# EAGLE design M2_Shield_Proto_V1.3 (EAGLE 9.5.2)
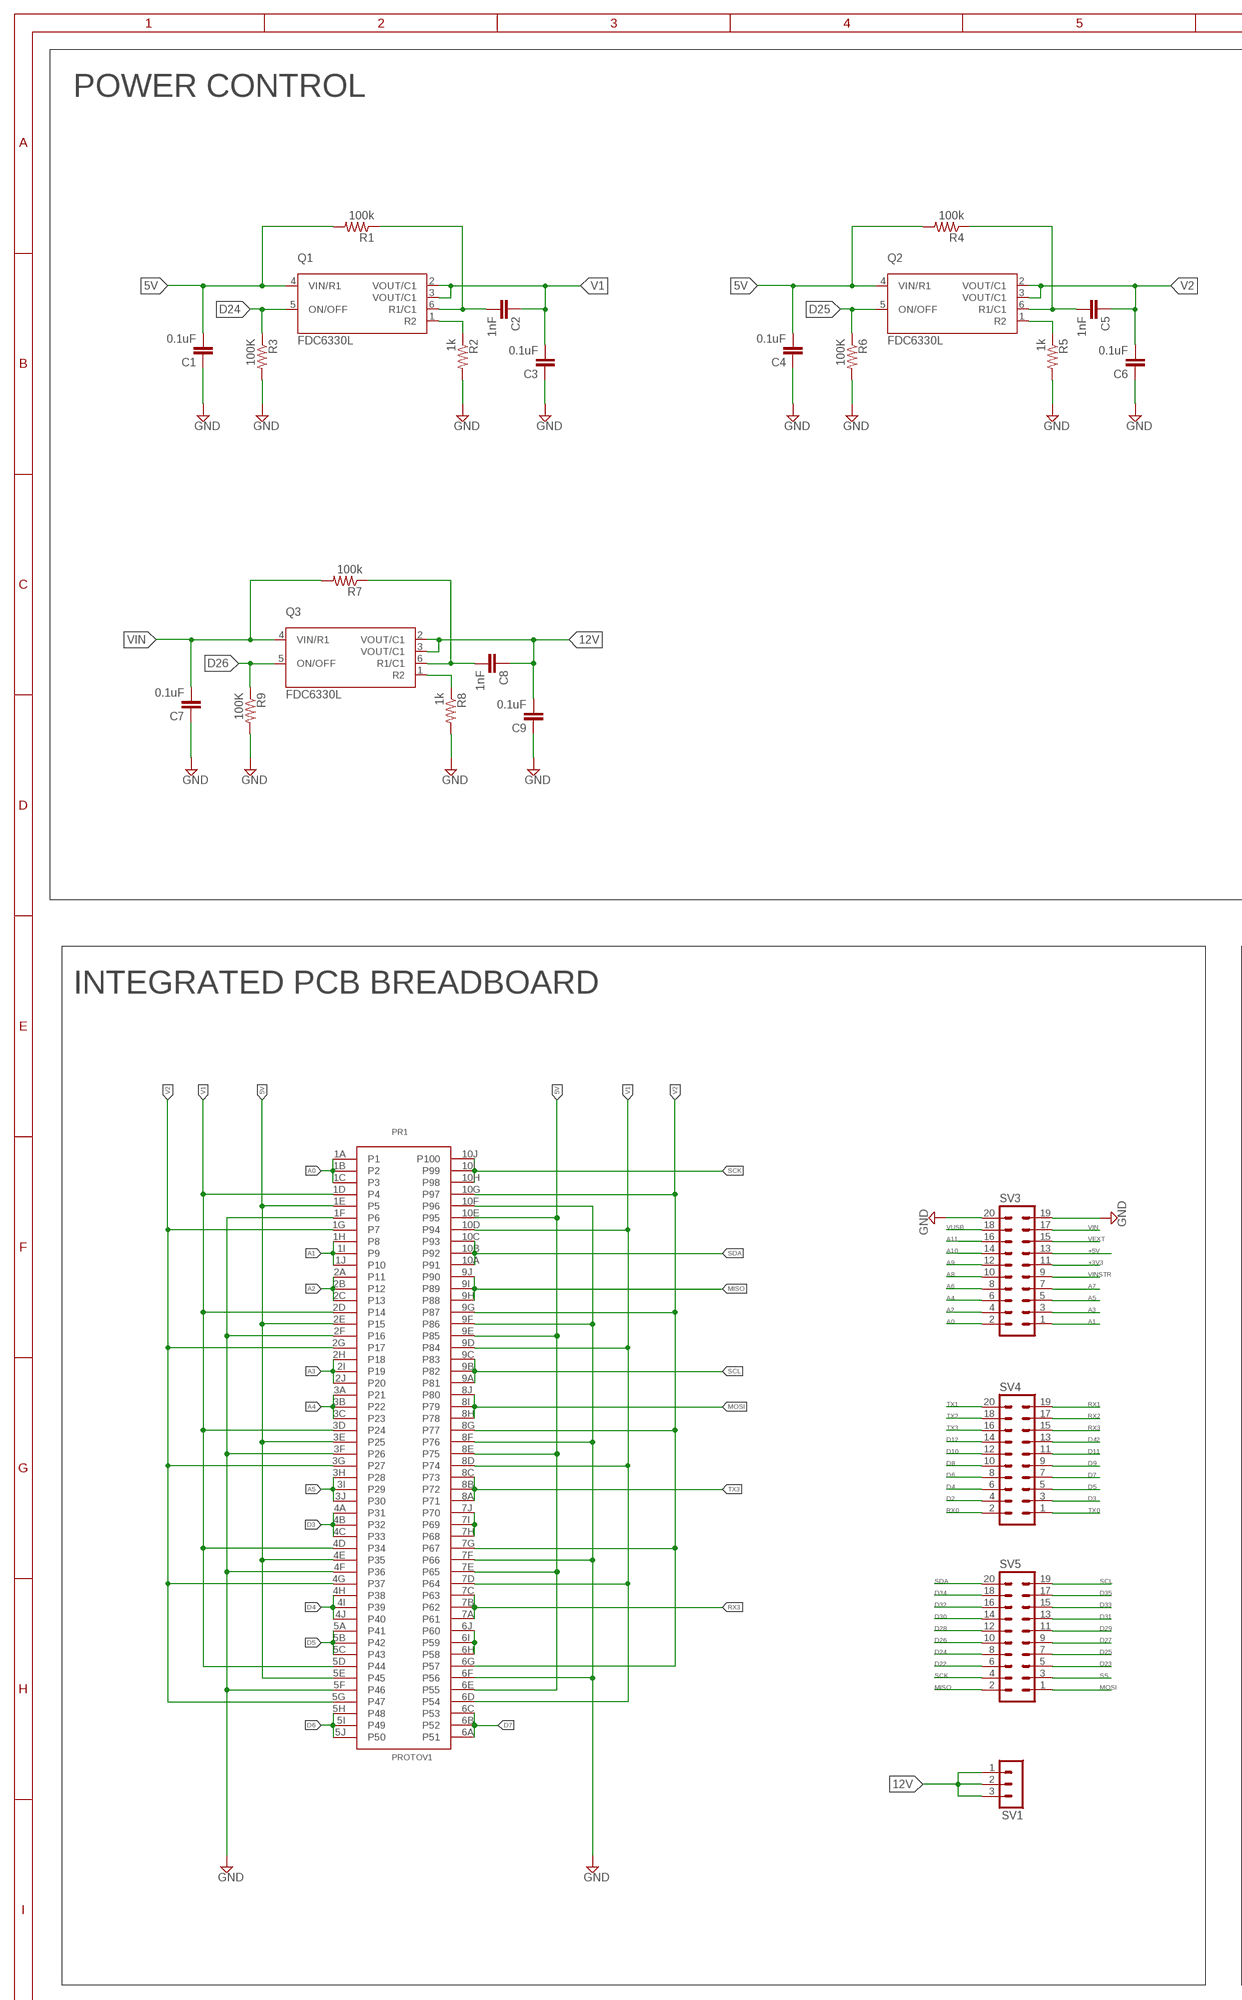
[diagram p0: schematic, sheet 1, part 1 of 2]
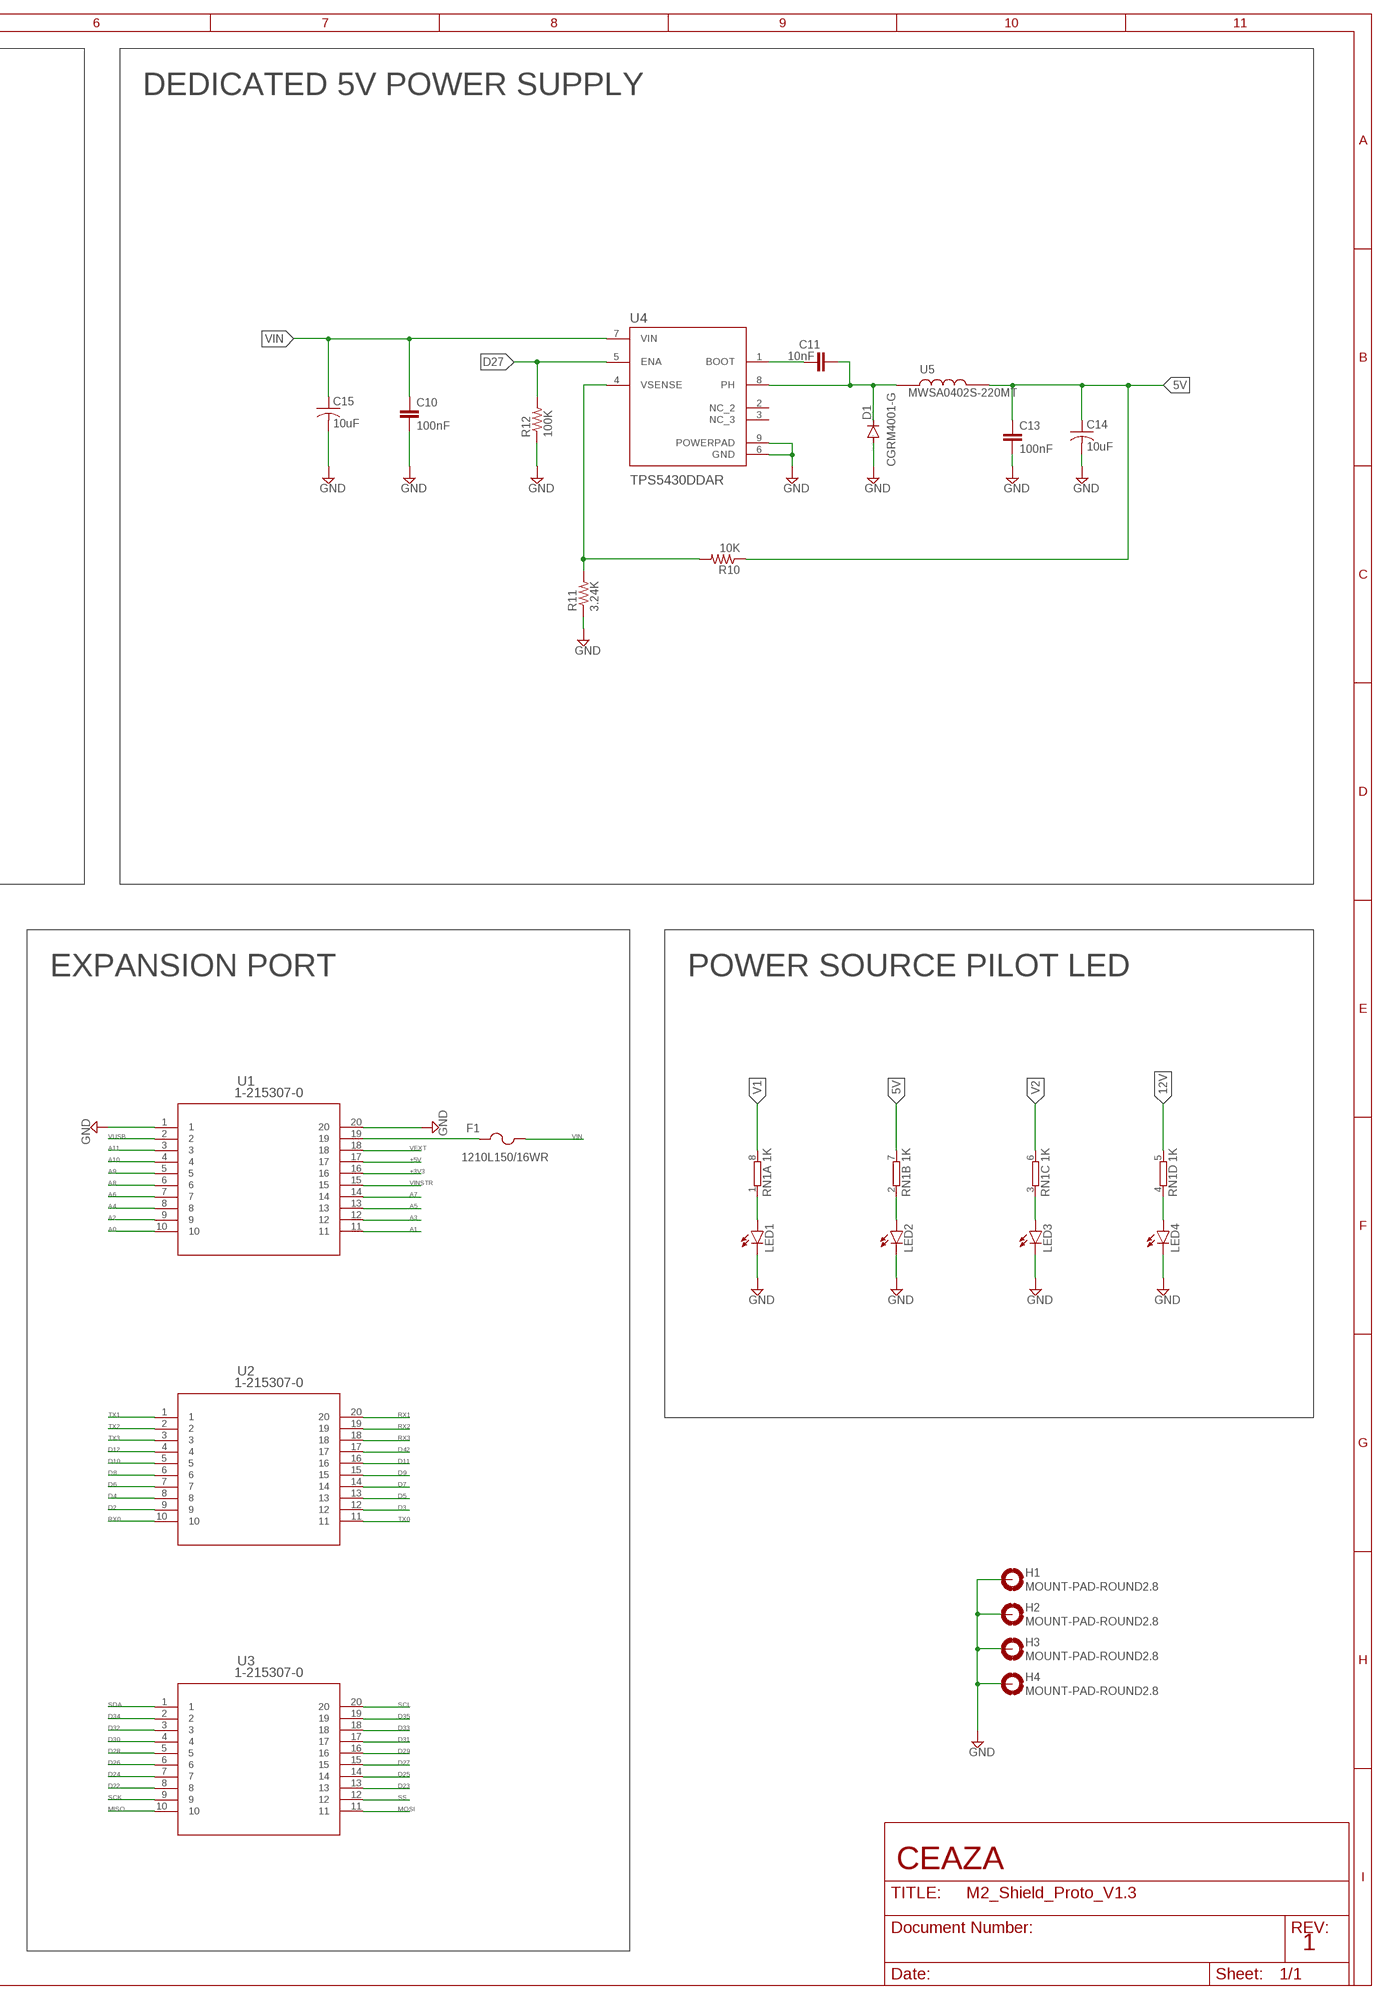
[diagram p1: schematic, sheet 1, part 2 of 2]

## Parts
C1  0.1uF  C-EUC0603  [C0603]
C2  1nF  C-EUC0603  [C0603]
C3  0.1uF  C-EUC0603  [C0603]
C4  0.1uF  C-EUC0603  [C0603]
C5  1nF  C-EUC0603  [C0603]
C6  0.1uF  C-EUC0603  [C0603]
C7  0.1uF  C-EUC0603  [C0603]
C8  1nF  C-EUC0603  [C0603]
C9  0.1uF  C-EUC0603  [C0603]
C10  100nF  C-EUC0603  [C0603]
C11  10nF  C-EUC0603  [C0603]
C13  100nF  C-EUC0603  [C0603]
C14  10uF  C-USC0603  [C0603]
C15  10uF  C-USC0603  [C0603]
D1  CGRM4001-G  [SOD-123_MINI-SMA]
F1  1210L150/16WR  [1210LSERIES]
H1  MOUNT-PAD-ROUND2.8  [2,8-PAD]
H2  MOUNT-PAD-ROUND2.8  [2,8-PAD]
H3  MOUNT-PAD-ROUND2.8  [2,8-PAD]
H4  MOUNT-PAD-ROUND2.8  [2,8-PAD]
LED1  LEDCHIP-LED0805  [CHIP-LED0805]
LED2  LEDCHIP-LED0805  [CHIP-LED0805]
LED3  LEDCHIP-LED0805  [CHIP-LED0805]
LED4  LEDCHIP-LED0805  [CHIP-LED0805]
PR1  PROTOV1  [PROTOV1]
Q1  FDC6330L  [SOT95P280X110-6N]
Q2  FDC6330L  [SOT95P280X110-6N]
Q3  FDC6330L  [SOT95P280X110-6N]
R1  100k  R-US_R0603  [R0603]
R2  1k  R-US_R0603  [R0603]
R3  100K  R-US_R0603  [R0603]
R4  100k  R-US_R0603  [R0603]
R5  1k  R-US_R0603  [R0603]
R6  100K  R-US_R0603  [R0603]
R7  100k  R-US_R0603  [R0603]
R8  1k  R-US_R0603  [R0603]
R9  100K  R-US_R0603  [R0603]
R10  10K  R-US_R0603  [R0603]
R11  3.24K  R-US_R0603  [R0603]
R12  100K  R-US_R0603  [R0603]
RN1  1K  4R-N0603-ARV  [0603-ARV]
SV1  MA03-1  [MA03-1]
SV3  MA10-2  [MA10-2]
SV4  MA10-2  [MA10-2]
SV5  MA10-2  [MA10-2]
U1  1-215307-0  [1-215307-0]
U2  1-215307-0  [1-215307-0]
U3  1-215307-0  [1-215307-0]
U4  TPS5430DDAR  [CONV_TPS5430DDAR]
U5  MWSA0402S-220MT  [MWSA0402S-220MT]

## Nets
5V: C1.2 C4.2 C13.1 C14.1 PR1.1E(P5) PR1.2E(P15) PR1.3E(P25) PR1.4E(P35) PR1.5E(P45) PR1.6E(P55) PR1.7E(P65) PR1.8E(P75) PR1.9E(P85) PR1.10E(P95) Q1.4(VIN/R1) Q2.4(VIN/R1) R1.2 R4.2 R10.1 RN1.7 U5.P$2
12V: C8.1 C9.2 Q3.2(VOUT/C1) Q3.3(VOUT/C1) RN1.5 SV1.1 SV1.2 SV1.3
+3V3: SV3.11 U1.16
+5V: SV3.13 U1.17
A0: PR1.1A(P1) PR1.1B(P2) PR1.1C(P3) SV3.2 U1.10
A1: PR1.1H(P8) PR1.1I(P9) PR1.1J(P10) SV3.1 U1.11
A2: PR1.2A(P11) PR1.2B(P12) PR1.2C(P13) SV3.4 U1.9
A3: PR1.2H(P18) PR1.2I(P19) PR1.2J(P20) SV3.3 U1.12
A4: PR1.3A(P21) PR1.3B(P22) PR1.3C(P23) SV3.6 U1.8
A5: PR1.3H(P28) PR1.3I(P29) PR1.3J(P30) SV3.5 U1.13
A6: SV3.8 U1.7
A7: SV3.7 U1.14
A8: SV3.10 U1.6
A9: SV3.12 U1.5
A10: SV3.14 U1.4
A11: SV3.16 U1.3
D2: SV4.4 U2.9
D3: PR1.4A(P31) PR1.4B(P32) PR1.4C(P33) SV4.3 U2.12
D4: PR1.4H(P38) PR1.4I(P39) PR1.4J(P40) SV4.6 U2.8
D5: PR1.5A(P41) PR1.5B(P42) PR1.5C(P43) SV4.5 U2.13
D6: PR1.5H(P48) PR1.5I(P49) PR1.5J(P50) SV4.8 U2.7
D7: PR1.6A(P51) PR1.6B(P52) PR1.6C(P53) SV4.7 U2.14
D8: SV4.10 U2.6
D9: SV4.9 U2.15
D10: SV4.12 U2.5
D11: SV4.11 U2.16
D12: SV4.14 U2.4
D22: SV5.6 U3.8
D23: SV5.5 U3.13
D24: Q1.5(ON/OFF) R3.1 SV5.8 U3.7
D25: Q2.5(ON/OFF) R6.1 SV5.7 U3.14
D26: Q3.5(ON/OFF) R9.1 SV5.10 U3.6
D27: R12.2 SV5.9 U3.15 U4.5(ENA)
D28: SV5.12 U3.5
D29: SV5.11 U3.16
D30: SV5.14 U3.4
D31: SV5.13 U3.17
D32: SV5.16 U3.3
D33: SV5.15 U3.18
D34: SV5.18 U3.2
D35: SV5.17 U3.19
D42: SV4.13 U2.17
GND: C1.1 C3.1 C4.1 C6.1 C7.1 C9.1 C10.2 C13.2 C14.2 C15.2 D1.A H1.B2,8(MOUNT) H2.B2,8(MOUNT) H3.B2,8(MOUNT) H4.B2,8(MOUNT) LED1.C LED2.C LED3.C LED4.C PR1.1F(P6) PR1.2F(P16) PR1.3F(P26) PR1.4F(P36) PR1.5F(P46) PR1.6F(P56) PR1.7F(P66) PR1.8F(P76) PR1.9F(P86) PR1.10F(P96) R2.2 R3.2 R5.2 R6.2 R8.2 R9.2 R11.1 R12.1 SV3.19 SV3.20 U1.1 U1.20 U4.6(GND) U4.9(POWERPAD)
MISO: PR1.9H(P88) PR1.9I(P89) PR1.9J(P90) SV5.2 U3.10
MOSI: PR1.8H(P78) PR1.8I(P79) PR1.8J(P80) SV5.1 U3.11
N$1: C11.1 U4.1(BOOT)
N$2: LED1.A RN1.1
N$3: LED2.A RN1.2
N$4: LED3.A RN1.3
N$5: LED4.A RN1.4
N$6: C11.2 D1.C U4.8(PH) U5.P$1
N$8: C2.2 Q1.6(R1/C1) R1.1
N$9: Q1.1(R2) R2.1
N$10: C5.2 Q2.6(R1/C1) R4.1
N$11: Q2.1(R2) R5.1
N$12: PR1.6H(P58) PR1.6I(P59) PR1.6J(P60)
N$13: PR1.7H(P68) PR1.7I(P69) PR1.7J(P70)
N$14: R10.2 R11.2 U4.4(VSENSE)
N$15: C8.2 Q3.6(R1/C1) R7.1
N$16: Q3.1(R2) R8.1
N$21: F1.1 U1.19
RX0: SV4.2 U2.10
RX1: SV4.19 U2.20
RX2: SV4.17 U2.19
RX3: PR1.7A(P61) PR1.7B(P62) PR1.7C(P63) SV4.15 U2.18
SCK: PR1.10H(P98) PR1.10I(P99) PR1.10J(P100) SV5.4 U3.9
SCL: PR1.9A(P81) PR1.9B(P82) PR1.9C(P83) SV5.19 U3.20
SDA: PR1.10A(P91) PR1.10B(P92) PR1.10C(P93) SV5.20 U3.1
SS: SV5.3 U3.12
TX0: SV4.1 U2.11
TX1: SV4.20 U2.1
TX2: SV4.18 U2.2
TX3: PR1.8A(P71) PR1.8B(P72) PR1.8C(P73) SV4.16 U2.3
V1: C2.1 C3.2 PR1.1D(P4) PR1.2D(P14) PR1.3D(P24) PR1.4D(P34) PR1.5D(P44) PR1.6D(P54) PR1.7D(P64) PR1.8D(P74) PR1.9D(P84) PR1.10D(P94) Q1.2(VOUT/C1) Q1.3(VOUT/C1) RN1.8
V2: C5.1 C6.2 PR1.1G(P7) PR1.2G(P17) PR1.3G(P27) PR1.4G(P37) PR1.5G(P47) PR1.6G(P57) PR1.7G(P67) PR1.8G(P77) PR1.9G(P87) PR1.10G(P97) Q2.2(VOUT/C1) Q2.3(VOUT/C1) RN1.6
VEXT: SV3.15 U1.18
VIN: C7.2 C10.1 C15.1 F1.2 Q3.4(VIN/R1) R7.2 SV3.17 U4.7(VIN)
VINSTR: SV3.9 U1.15
VUSB: SV3.18 U1.2
Unconnected: U4.2(NC_2) U4.3(NC_3)

## Notes on the sheet
- POWER CONTROL | DEDICATED 5V POWER SUPPLY
- INTEGRATED PCB BREADBOARD | EXPANSION PORT | POWER SOURCE PILOT LED
- CEAZA
- 1

## Library data of the parts
C1-C11 C13 = rcl:C-EU: CAPACITOR, European symbol; SPICEPREFIX: C
C14 C15 = rcl:C-US: CAPACITOR, American symbol; SPICEPREFIX: C
D1 = diode:CGRM400*-G: Molded plasitc,JEDEC SOD-123/Mini SMA Source: Comchip CGRM4001-G.pdf
F1 = 1210L150-16WR:1210L150/16WR; BUILT_BY: EMA_UL_Team; MANUFACTURER_PART_NUMBER: 1210L150/16WR; VENDOR: Littelfuse Inc
H1-H4 = holes:MOUNT-PAD-ROUND: MOUNTING PAD, round
LED1-LED4 = led:LED: LED OSRAM: - CHIPLED LG R971, LG N971, LY N971, LG Q971, LY Q971, LO R971, LY R971 LH N974, LH R974 LS Q976, LO Q976, LY Q976 LO Q996 - Hyper CHIPLED LW Q18S LB Q993, LB Q99A, LB R99A - SideLED LS A670, LO A670, LY A670, LG A670, LP A670 LB A673, LV A673, LT A673, LW A673 LH A674 LY A675 LS A676, LA A676, LO A676, LY A676, LW A676 LS A679, LY A679, LG A679 - Hyper Micro SIDELED® LS Y876, LA Y876, LO Y876, LY Y876 LT Y87S - SmartLED LW L88C, LW L88S LB L89C, LB L89S, LG L890 LS L89K, LO L89K, LY L89K LS L896, LA L896, LO L896, LY L896 - TOPLED LS T670, LO T670, LY T670, LG T670, LP T670 LSG T670, LSP T670, LSY T670, LOP T670, LYG T670 LG T671, LOG T671, LSG T671 LB T673, LV T673, LT T673, LW T673 LH T674 LS T676, LA T676, LO T676, LY T676, LB T676, LH T676, LSB T676, LW T676 LB T67C, LV T67C, LT T67C, LS T67K, LO T67K, LY T67K, LW E67C LS E67B, LA E67B, LO E67B, LY E67B, LB E67C, LV E67C, LT E67C LW T67C LS T679, LY T679, LG T679 LS T770, LO T770, LY T770, LG T770, LP T770 LB T773, LV T773, LT T773, LW T773 LH T774 LS E675, LA E675, LY E675, LS T675 LS T776, LA T776, LO T776, LY T776, LB T776 LHGB T686 LT T68C, LB T68C - Hyper Mini TOPLED® LB M676 - Mini TOPLED Santana® LG M470 LS M47K, LO M47K, LY M47K Source: http://www.osram.convergy.de LUXEON: - LUMILED® LXK2-PW12-R00, LXK2-PW12-S00, LXK2-PW14-U00, LXK2-PW14-V00 LXK2-PM12-R00, LXK2-PM12-S00, LXK2-PM14-U00 LXK2-PE12-Q00, LXK2-PE12-R00, LXK2-PE12-S00, LXK2-PE14-T00, LXK2-PE14-U00 LXK2-PB12-K00, LXK2-PB12-L00, LXK2-PB12-M00, LXK2-PB14-N00, LXK2-PB14-P00, LXK2-PB14-Q00 LXK2-PR12-L00, LXK2-PR12-M00, LXK2-PR14-Q00, LXK2-PR14-R00 LXK2-PD12-Q00, LXK2-PD12-R00, LXK2-PD12-S00 LXK2-PH12-R00, LXK2-PH12-S00 LXK2-PL12-P00, LXK2-PL12-Q00, LXK2-PL12-R00 Source: www.luxeon.com KINGBRIGHT: KA-3528ASYC Source: www.kingbright.com
PR1 = PROTOBOARD:PROTOV1
Q1-Q3 = FDC6330L:FDC6330L: FDC6330 Series 20 V 2.3 A High Side Integrated Load Switch - SSOT-6; DESCRIPTION: Power Switch/Driver 1:1 P-Channel 2.3A SuperSOT™-6; DIGI-KEY_PART_NUMBER: FDC6330LCT-ND; DIGI-KEY_PURCHASE_URL: https://www.digikey.com/product-detail/en/on-semiconductor/FDC6330L/FDC6330LCT-ND/1626189?utm_source=snapeda&utm_medium=aggregator&utm_campaign=symbol; MF: ON Semiconductor; MP: FDC6330L; PACKAGE: TSOT-23-6 ON Semiconductor
R1-R12 = rcl:R-US_: RESISTOR, American symbol; SPICEPREFIX: R
RN1 = resistor-dil:4R-N: Array Chip Resistor Source: RS Component / Phycomp; OC_FARNELL: unknown; OC_NEWARK: unknown
SV1 = con-lstb:MA03-1: PIN HEADER; OC_FARNELL: unknown; OC_NEWARK: unknown
SV3-SV5 = con-lstb:MA10-2: PIN HEADER; OC_FARNELL: unknown; OC_NEWARK: unknown
U1-U3 = 1-215307-0:1-215307-0; BUILT_BY: EMA_UL_Team; MANUFACTURER_PART_NUMBER: 1-215307-0; VENDOR: TE Connectivity
U4 = TPS5430DDAR:TPS5430DDAR: 5.5V to 36V Input, 3A, 500kHz Step-Down Converter 8-SO PowerPAD -40 to 125 Check prices <https://snapeda.com/parts/TPS5430DDAR/Texas%20Instruments/view-part/?ref=eda>; ARROW_ELECTRONICS-PURCHASE-URL: https://snapeda.com/shop?store=Arrow+Electronics&id=423058; AVAILABILITY: Good; DESCRIPTION: 5.5V to 36V Input, 3A, 500kHz Step-Down Converter 8-SO PowerPAD -40 to 125; DIGIKEY-PURCHASE-URL: https://snapeda.com/shop?store=DigiKey&id=423058; MF: Texas Instruments; MOUSER-PURCHASE-URL: https://snapeda.com/shop?store=Mouser&id=423058; MP: TPS5430DDAR; PACKAGE: HSOIC-8 Texas Instruments; PRICE: None; TEXAS_INSTRUMENTS-PURCHASE-URL: https://snapeda.com/shop?store=Texas+Instruments&id=423058
U5 = MWSA0402S-220MT:MWSA0402S-220MT

## Board
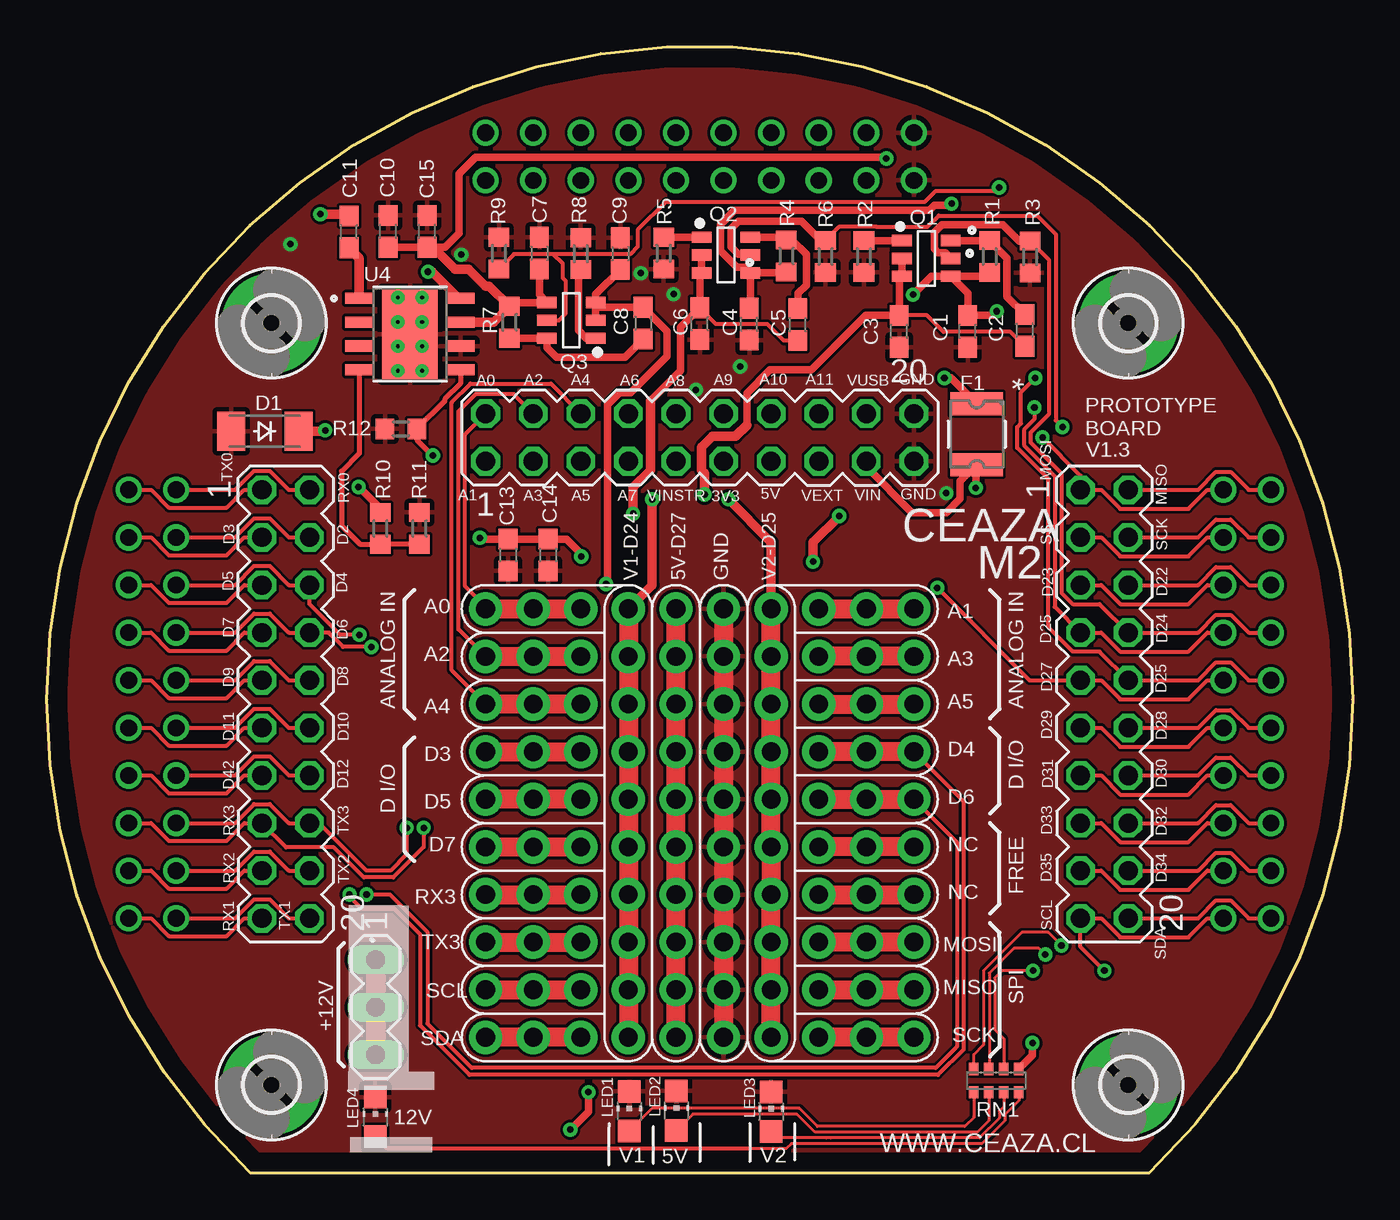
[diagram p2: board, top side]
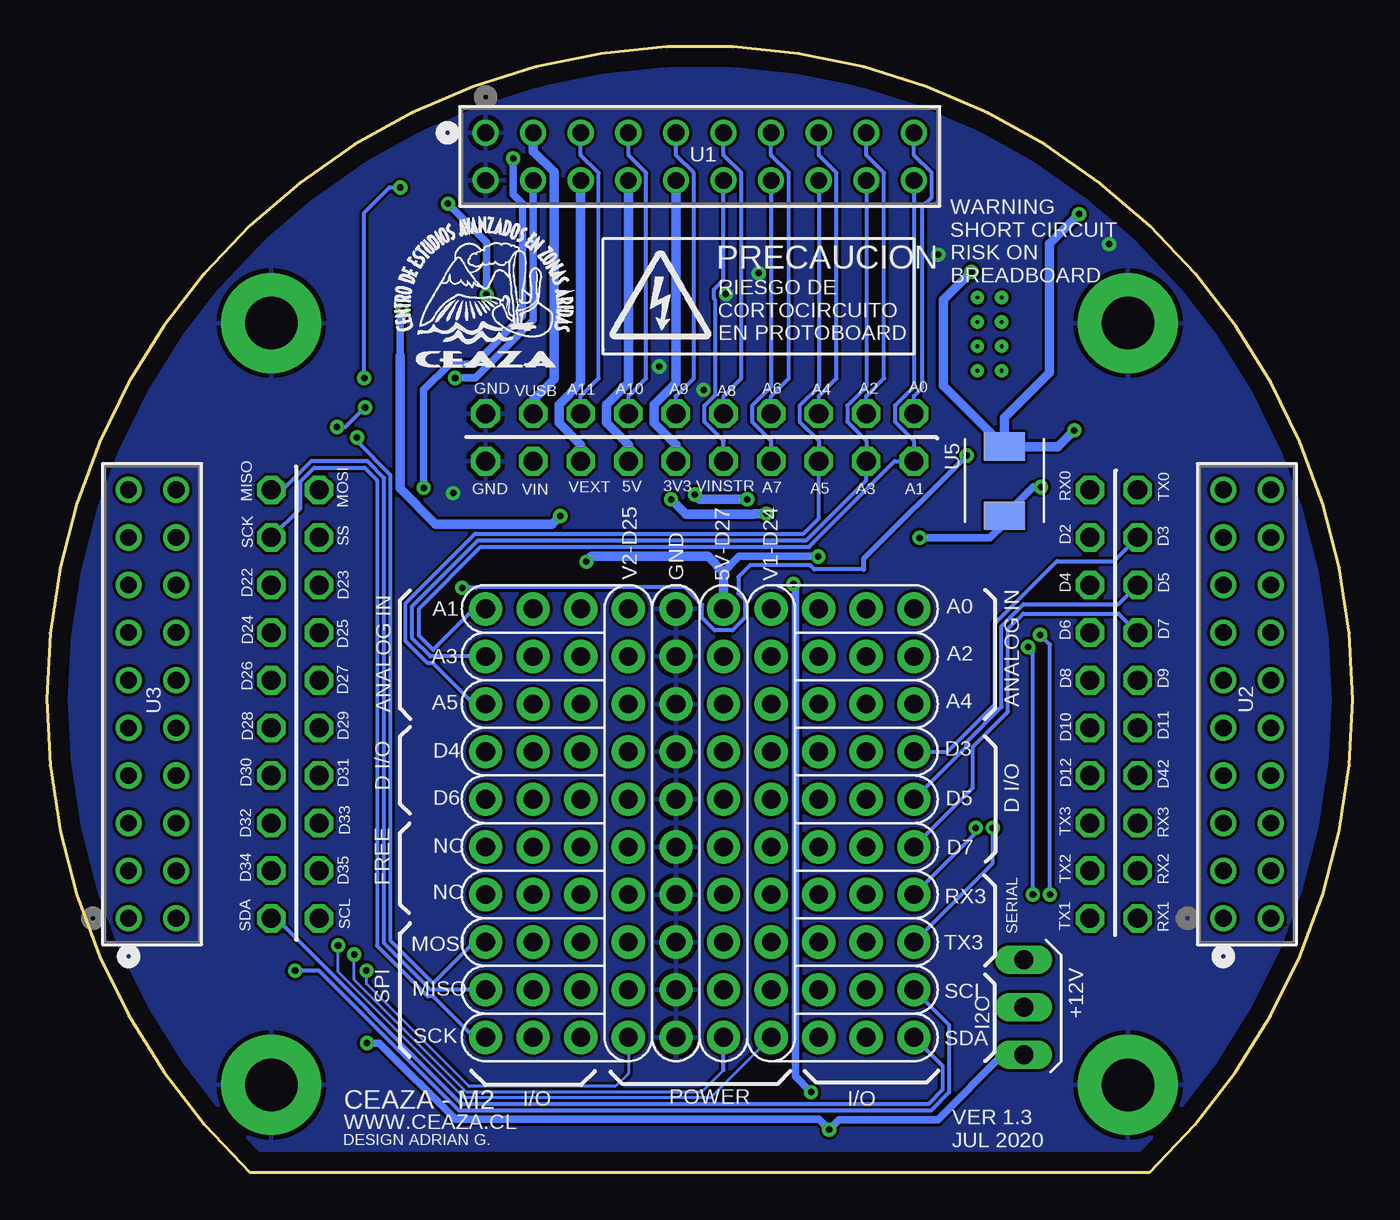
[diagram p3: board, bottom side, seen from below]

Size 69.69 x 60.06 mm. Coordinates in mm from the lower left corner, seen from the top.
Outline: 10.85,0 58.84,0 arc273 10.85,0
Copper layers (1*16): Top 0.035mm / dielectric 1.5mm / Bottom 0.035mm
Design rules "default *": minimum track width 6mil, minimum drill 0.35mm, track to track 6mil, track to pad 6mil, pad to pad 6mil, via to via 6mil, smd to smd 6mil, copper to edge 40mil, drill to drill 6mil, minimum pad ring 10mil, minimum via ring 8mil, stop-mask expansion 2mil, vias tented up to drill 24mil, thermal gap 10mil

### Footprints (pad centres in the part's own frame; a part is rotated, then mirrored left to right if it is on the bottom)
C0603 = smd 1.1 x 1: 1 -0.85,0; 2 0.85,0
SOD-123_MINI-SMA = smd 1.5 x 2.1: A 1.8,0; C -1.8,0
1210LSERIES = smd 1.219 x 2.794: 1 -1.626,0; 2 1.626,0
2,8-PAD = drill 2.8 pad 5.334: B2,8 0,0
CHIP-LED0805 = smd 1.2 x 1.2: A 0,-1.05; C 0,1.05
PROTOV1 = drill 1 pad 1.778: 1A 0,0; 1B 2.54,0; 1C 5.08,0; 1D 7.62,0; 1E 10.16,0; 1F 12.7,0; 1G 15.24,0; 1H 17.78,0; 1I 20.32,0; 1J 22.86,0; 2A 0,-2.54; 2B 2.54,-2.54; 2C 5.08,-2.54; 2D 7.62,-2.54; 2E 10.16,-2.54; 2F 12.7,-2.54; 2G 15.24,-2.54; 2H 17.78,-2.54; 2I 20.32,-2.54; 2J 22.86,-2.54; 3A 0,-5.08; 3B 2.54,-5.08; 3C 5.08,-5.08; 3D 7.62,-5.08; 3E 10.16,-5.08; 3F 12.7,-5.08; 3G 15.24,-5.08; 3H 17.78,-5.08; 3I 20.32,-5.08; 3J 22.86,-5.08; 4A 0,-7.62; 4B 2.54,-7.62; 4C 5.08,-7.62; 4D 7.62,-7.62; 4E 10.16,-7.62; 4F 12.7,-7.62; 4G 15.24,-7.62; 4H 17.78,-7.62; 4I 20.32,-7.62; 4J 22.86,-7.62; 5A 0,-10.16; 5B 2.54,-10.16; 5C 5.08,-10.16; 5D 7.62,-10.16; 5E 10.16,-10.16; 5F 12.7,-10.16; 5G 15.24,-10.16; 5H 17.78,-10.16; 5I 20.32,-10.16; 5J 22.86,-10.16; 6A 0,-12.7; 6B 2.54,-12.7; 6C 5.08,-12.7; 6D 7.62,-12.7; 6E 10.16,-12.7; 6F 12.7,-12.7; 6G 15.24,-12.7; 6H 17.78,-12.7; 6I 20.32,-12.7; 6J 22.86,-12.7; 7A 0,-15.24; 7B 2.54,-15.24; 7C 5.08,-15.24; 7D 7.62,-15.24; 7E 10.16,-15.24; 7F 12.7,-15.24; 7G 15.24,-15.24; 7H 17.78,-15.24; 7I 20.32,-15.24; 7J 22.86,-15.24; 8A 0,-17.78; 8B 2.54,-17.78; 8C 5.08,-17.78; 8D 7.62,-17.78; 8E 10.16,-17.78; 8F 12.7,-17.78; 8G 15.24,-17.78; 8H 17.78,-17.78; 8I 20.32,-17.78; 8J 22.86,-17.78; 9A 0,-20.32; 9B 2.54,-20.32; 9C 5.08,-20.32; 9D 7.62,-20.32; 9E 10.16,-20.32; 9F 12.7,-20.32; 9G 15.24,-20.32; 9H 17.78,-20.32; 9I 20.32,-20.32; 9J 22.86,-20.32; 10A 0,-22.86; 10B 2.54,-22.86; 10C 5.08,-22.86; 10D 7.62,-22.86; 10E 10.16,-22.86; 10F 12.7,-22.86; 10G 15.24,-22.86; 10H 17.78,-22.86; 10I 20.32,-22.86; 10J 22.86,-22.86
SOT95P280X110-6N = smd 1.05 x 0.6: 1 -1.3,0.95; 2 -1.3,0; 3 -1.3,-0.95; 4 1.3,-0.95; 5 1.3,0; 6 1.3,0.95
R0603 = smd 1 x 1.1: 1 -0.85,0; 2 0.85,0
0603-ARV = smd 0.5 x 0.65: 1 -1.2,-0.625; 2 -0.4,-0.625; 3 0.4,-0.625; 4 1.2,-0.625; 5 1.2,0.625; 6 0.4,0.625; 7 -0.4,0.625; 8 -1.2,0.625
MA03-1 = drill 1.016 long: 1 -2.54,0; 2 0,0; 3 2.54,0
MA10-2 = drill 1.016 octagon: 1 -11.43,-1.27; 2 -11.43,1.27; 3 -8.89,-1.27; 4 -8.89,1.27; 5 -6.35,-1.27; 6 -6.35,1.27; 7 -3.81,-1.27; 8 -3.81,1.27; 9 -1.27,-1.27; 10 -1.27,1.27; 11 1.27,-1.27; 12 1.27,1.27; 13 3.81,-1.27; 14 3.81,1.27; 15 6.35,-1.27; 16 6.35,1.27; 17 8.89,-1.27; 18 8.89,1.27; 19 11.43,-1.27; 20 11.43,1.27
1-215307-0 = drill 0.889 pad 1.397: 1 -22.86,2.54; 2 -20.32,2.54; 3 -17.78,2.54; 4 -15.24,2.54; 5 -12.7,2.54; 6 -10.16,2.54; 7 -7.62,2.54; 8 -5.08,2.54; 9 -2.54,2.54; 10 0,2.54; 11 0,0; 12 -2.54,0; 13 -5.08,0; 14 -7.62,0; 15 -10.16,0; 16 -12.7,0; 17 -15.24,0; 18 -17.78,0; 19 -20.32,0; 20 -22.86,0
CONV_TPS5430DDAR = smd 1.55 x 0.6: 1 -2.7,1.905; 2 -2.7,0.635; 3 -2.7,-0.635; 4 -2.7,-1.905; 5 2.7,-1.905; 6 2.7,-0.635; 7 2.7,0.635; 8 2.7,1.905 | smd 2.95 x 4.9: 9 0,0 | drill 0.2 pad 0.3: 10 -0.65,1.95; 11 0.65,1.95; 12 -0.65,0.65; 13 0.65,0.65; 14 -0.65,-0.65; 15 0.65,-0.65; 16 -0.65,-1.95; 17 0.65,-1.95
MWSA0402S-220MT = smd 1.5 x 2.2: P$1 -1.8,0; P$2 1.9,0

### Placement (x,y rotation side)
C1  49.15,44.89 90 top
C2  52.19,44.94 90 top
C3  45.49,44.89 90 top
C4  37.49,45.27 90 top
C5  40.08,45.24 90 top
C6  34.85,45.29 90 top
C7  26.29,49.05 270 top
C8  31.82,45.32 270 top
C9  30.6,49.03 270 top
C10  18.21,50.22 90 top
C11  16.13,50.2 90 top
C13  24.61,32.95 270 top
C14  26.74,32.95 270 top
C15  20.29,50.22 90 top
D1  11.63,39.55 180 top
F1  49.63,39.4 270 top
H1  57.71,45.32 0 top
H2  57.71,4.68 0 top
H3  11.99,4.68 0 top
H4  11.99,45.32 0 top
LED1  31.09,3.28 0 top
LED2  33.6,3.31 0 top
LED3  38.66,3.26 0 top
LED4  17.52,2.98 0 top
PR1  23.42,30.08 0 top
Q1  46.94,48.77 0 top
Q2  36.24,48.95 0 top
Q3  27.99,45.47 180 top
R1  50.31,48.88 270 top
R2  43.61,48.88 270 top
R3  52.47,48.85 270 top
R4  39.47,48.9 270 top
R5  32.91,49.05 270 top
R6  41.55,48.88 270 top
R7  24.69,45.37 90 top
R8  28.5,49.03 90 top
R9  24.13,49.05 90 top
R10  17.8,34.37 270 top
R11  19.88,34.37 270 top
R12  18.89,39.68 0 top
RN1  50.67,4.91 0 top
SV1  17.55,8.82 270 top
SV3  34.85,39.22 0 top
SV4  12.75,25 270 top
SV5  56.44,25 270 top
U1  23.42,52.94 0 bottom
U2  4.37,36.43 90 bottom
U3  62.79,36.43 90 bottom
U4  19.38,44.74 0 top
U5  18.59,36.94 270 bottom

### Tracks (layer width: path | path; a pad name or v marks a point on that pad's centre or on a via)
5V  (via drill 0.35)
  Top 0.152: v53.29,11.64 v53.28,11.64 52.95,11.97 51.61,11.97 50.29,10.65 50.29,5.55 RN1.7
  Top 0.406: Q1.4 50.11,47.82 R1.2 | Q1.4 49.15,46.91 C1.2 50.48,45.74 v50.7,45.96 | Q2.4 39.42,48 R4.2 | C4.2 37.54,46.18 Q2.4 | Q2.4 37.25,48.3 36.83,48.3 35.95,49.17 35.95,50.58 36.71,51.34 47.1,51.34 47.38,51.62 48.2,51.62 v48.28,51.7 | Q1.4 47.21,47.82 v46.22,46.84 | v28.52,32.87 28.52,33.03 27.75,33.8 C14.1 C13.1 23.18,33.8 v23.11,33.87 | v16.63,36.58 17.8,35.41 R10.1
  Top 0.508: v40.89,32.59 40.89,33.64 v42.29,35.03
  Top 1.016: PR1.1E PR1.2E PR1.3E PR1.4E PR1.5E PR1.6E PR1.7E PR1.8E PR1.9E PR1.10E
  Bottom 0.152: 33.58,5.47 34.74,4.3 47.28,4.3 53.29,10.3 v53.29,11.64
  Bottom 0.203: 33.58,5.47 PR1.10E
  Bottom 0.406: v46.22,46.84 46.22,49.64 v48.28,51.7 | v28.52,32.87 32.74,32.87 33.58,32.04 | 50.85,43.59 50.85,45.8 v50.7,45.96 | v23.11,33.87 19.35,33.87 18.59,34.63 U5.P$2 17.05,36.58 v16.63,36.58
  Bottom 0.508: PR1.1E 33.58,32.04 34.41,32.87 40.61,32.87 v40.89,32.59 | v42.29,35.03 42.72,34.6 48.94,34.6 50.85,36.51 50.85,43.59 | U5.P$2 18.59,35.02
12V  (via drill 0.35)
  Top 0.406: C9.2 29.29,46.86 Q3.3 | Q3.3 Q3.2 | Q3.3 29.54,46.17 C8.1 33.09,44.9 33.09,43.57 31.14,41.61 30.57,41.61 29.92,40.96 29.92,31.48 v29.84,31.4 | v28.9,4.3 28.9,3.26 v27.94,2.29 | v52.6,6.92 52.6,6.26 RN1.5
  Top 1.016: SV1.1 SV1.2 SV1.3
  Bottom 0.406: v29.84,31.4 29.74,31.3 29.74,5.13 v28.9,4.3 | v52.6,6.92 51.95,6.92 47.88,2.85 28.5,2.85 v27.94,2.29 27.4,2.83 22.15,2.83 18.69,6.28 SV1.3
+3V3
  Bottom 0.508: U1.16 36.12,42.15 37.28,40.98 37.28,40.01 36.12,38.84 SV3.11
+5V
  Bottom 0.508: U1.17 38.66,42.15 39.82,40.98 39.82,40.01 38.66,38.84 SV3.13
A0
  Top 0.203: PR1.1A 23.52,30.08 22.32,31.27 22.32,39.4 SV3.2
  Top 1.016: PR1.1A PR1.1B PR1.1C
  Bottom 0.203: SV3.2 23.42,41.43 22.96,41.89 22.96,51.56 22.46,52.05 22.46,53.34 23.42,54.29 U1.10
A1
  Top 1.016: PR1.1H PR1.1I PR1.1J
  Bottom 0.203: U1.11 23.42,41.93 24.43,40.91 24.43,40.07 23.42,39.06 SV3.1 24.44,37.95 29.01,33.38 46.53,33.38 49.83,30.08 49.83,28.66 49.07,27.9 46.89,30.08 PR1.1J
A2
  Top 0.203: PR1.2A 21.97,28.99 21.97,40.62 22.89,41.54 24.91,41.54 SV3.4
  Top 1.016: PR1.2A PR1.2B PR1.2C
  Bottom 0.203: SV3.4 25.96,41.43 25,42.38 25,53.34 25.96,54.29 U1.9
A3
  Top 1.016: PR1.2J PR1.2I PR1.2H
  Bottom 0.203: U1.12 25.96,41.93 26.97,40.91 26.97,40.07 25.96,39.06 SV3.3 25.96,36.94 29.16,33.74 46.68,33.74 50.19,30.23 50.19,28.51 49.22,27.54 PR1.2J
A4
  Top 0.203: PR1.3A 21.61,26.8 21.61,41.09 22.61,42.09 26.9,42.09 SV3.6
  Top 1.016: PR1.3C PR1.3B PR1.3A
  Bottom 0.203: SV3.6 28.5,41.43 27.54,42.38 27.54,53.34 28.5,54.29 U1.8
A5
  Top 1.016: PR1.3H PR1.3I PR1.3J
  Bottom 0.203: U1.13 28.5,41.93 29.51,40.91 29.51,40.07 28.5,39.06 SV3.5 28.5,34.91 29.31,34.09 46.82,34.09 50.54,30.37 50.54,28.36 49.36,27.18 49.07,27.18 46.89,25 PR1.3J
A6
  Bottom 0.203: SV3.8 31.04,41.43 30.08,42.38 30.08,53.34 31.04,54.29 U1.7
A7
  Bottom 0.203: U1.14 31.04,41.93 32.05,40.91 32.05,40.07 31.04,39.06 SV3.7
A8
  Bottom 0.203: SV3.10 33.58,41.43 32.62,42.38 32.62,53.34 33.58,54.29 U1.6
A9
  Bottom 0.203: SV3.12 36.12,41.43 35.16,42.38 35.16,53.34 36.12,54.29 U1.5
A10
  Bottom 0.203: SV3.14 38.66,41.43 37.7,42.38 37.7,53.34 38.66,54.29 U1.4
A11
  Bottom 0.203: SV3.16 41.2,41.43 40.24,42.38 40.24,53.34 41.2,54.29 U1.3
D2
  Top 0.203: U2.9 10.04,33.89 11.06,34.91 11.9,34.91 12.91,33.89 SV4.4
D3
  Top 0.203: SV4.3 10.54,33.89 9.59,32.94 6.51,32.94 5.56,33.89 U2.12
  Top 1.016: PR1.4A PR1.4B PR1.4C
  Bottom 0.203: PR1.4A 21.64,22.46 19.1,25 19.1,29.31 15.79,32.62 12.75,32.62 SV4.3
D4  (via drill 0.35)
  Top 0.203: U2.8 10.04,31.35 11.06,32.37 11.9,32.37 12.91,31.35 SV4.6 14.02,30.33 15.66,28.69 v16.68,28.69 | PR1.4J 48.92,19.82 48.92,6.57 47.57,5.21 22.56,5.21 19.92,7.85 19.92,12.73 18.54,14.11 16.76,14.11 16.16,14.71 v16.16,14.84
  Top 1.016: PR1.4J PR1.4I PR1.4H
  Bottom 0.203: v16.16,14.84 16.16,28.17 v16.68,28.69
D5
  Top 0.203: SV4.5 10.54,31.35 9.59,30.4 6.51,30.4 5.56,31.35 U2.13
  Top 1.016: PR1.5C PR1.5B PR1.5A
  Bottom 0.203: PR1.5A 20.62,22.71 20.62,22.97 18.74,24.85 18.74,29.16 17.57,30.33 12.49,30.33 SV4.5
D6  (via drill 0.35)
  Top 0.203: U2.7 10.04,28.81 11.06,29.83 11.9,29.83 12.91,28.81 SV4.8 15.04,28.81 15.8,28.05 v17.32,28.05 | PR1.5J 48.56,17.63 48.56,6.71 47.44,5.59 22.68,5.59 20.32,7.96 20.32,12.83 18.31,14.84 v17.07,14.84
  Top 1.016: PR1.5H PR1.5I PR1.5J
  Bottom 0.203: v17.07,14.84 17.07,27.79 v17.32,28.05
D7
  Top 0.203: SV4.7 10.54,28.81 9.59,27.86 6.51,27.86 5.56,28.81 U2.14
  Top 1.016: PR1.6A PR1.6B PR1.6C
  Bottom 0.203: PR1.6A 20.27,20.53 20.27,22.72 18.39,24.6 18.39,29.01 17.57,29.83 12.49,29.83 SV4.7
D8
  Top 0.203: U2.6 10.04,26.27 11.06,27.29 11.9,27.29 12.91,26.27 SV4.10
D9
  Top 0.203: SV4.9 10.54,26.27 9.59,25.32 6.51,25.32 5.56,26.27 U2.15
D10
  Top 0.203: U2.5 10.04,23.73 11.06,24.75 11.9,24.75 12.91,23.73 SV4.12
D11
  Top 0.203: SV4.11 10.54,23.73 9.59,22.78 6.51,22.78 5.56,23.73 U2.16
D12
  Top 0.203: U2.4 10.04,21.19 11.06,22.21 11.9,22.21 12.91,21.19 SV4.14
D22
  Top 0.203: SV5.6 61.44,31.35 62.39,32.3 63.18,32.3 64.13,31.35 U3.8
D23
  Top 0.203: U3.13 61.94,31.35 60.93,30.33 57.28,30.33 56.27,31.35 SV5.5
D24
  Top 0.203: U3.7 64.13,28.81 63.18,29.76 62.39,29.76 61.44,28.81 SV5.8 56.18,30.33 54.74,30.33 54.15,30.93 54.15,37.31 52.5,38.96 52.5,39.49 53.46,40.45 53.46,48.71 R3.1
  Top 0.406: Q1.5 47.94,49.07 47.56,49.07 47.36,49.28 47.36,50.17 47.77,50.58 51.01,50.58 51.89,49.7 R3.1
D25  (via drill 0.35)
  Top 0.203: U3.14 61.94,28.81 60.93,27.79 57.28,27.79 56.27,28.81 SV5.7 53.79,30.18 53.79,37.17 52.15,38.82 52.15,39.63 52.7,40.19 v52.7,40.82 | v54.2,39.78 53.84,40.14 53.84,50.07 52.85,51.06 47.6,51.06 46.99,50.45 44.29,50.45 44.26,50.48 42.31,50.48 R6.1
  Top 0.406: R6.1 41.3,49.73 40.27,50.76 36.92,50.76 36.51,50.35 36.51,49.4 36.92,48.99 37.5,48.99 Q2.5
  Bottom 0.203: v54.2,39.78 53.74,39.78 v52.7,40.82
D26  (via drill 0.35)
  Top 0.203: U3.6 64.13,26.27 63.18,27.22 62.39,27.22 61.44,26.27 SV5.10 56.18,27.79 54.74,27.79 53.44,29.1 53.44,37.02 51.79,38.67 51.79,39.78 51.99,39.98 51.99,41.64 v52.75,42.4 | 27.02,49.01 31.14,49.01 31.54,49.4 31.54,50.3 33.03,51.8 46.86,51.8 47.42,52.36 50.62,52.36 v50.82,52.56 | 27.02,49.01 25.68,49.01 25.68,49 24.93,49 R9.1 | Q3.5 27.33,45.47 27.71,45.85 27.71,47.56 27.54,47.73 27.54,48.49 27.02,49.01
  Bottom 0.203: v52.75,42.4 52.75,51.21 51.41,52.56 v50.82,52.56
D27  (via drill 0.35)
  Top 0.203: U3.15 61.94,26.27 60.93,25.25 57.28,25.25 56.27,26.27 SV5.9 52.45,26.27 v47.52,31.2
  Top 0.254: U4.5 22.08,42.1 21.23,41.25 21.23,41.17 R12.2 19.74,39.11 v20.6,38.26
  Bottom 0.203: 26.08,32.19 28.73,32.19 28.96,32.42 32.15,32.42 32.79,31.78 32.79,30.91 32.43,30.55 32.43,29.61 33.1,28.94 34.05,28.94 34.72,29.61 34.72,30.3 35.64,31.22 46.75,31.22 46.77,31.2 v47.52,31.2
  Bottom 0.254: 26.08,32.19 26.08,32.77 v20.6,38.26
D28
  Top 0.203: SV5.12 61.44,23.73 62.39,24.68 63.18,24.68 64.13,23.73 U3.5
D29
  Top 0.203: U3.16 61.94,23.73 60.93,22.71 57.28,22.71 56.27,23.73 SV5.11
D30
  Top 0.203: SV5.14 61.44,21.19 62.39,22.14 63.18,22.14 64.13,21.19 U3.4
D31
  Top 0.203: U3.17 61.94,21.19 60.93,20.17 57.28,20.17 56.27,21.19 SV5.13
D32
  Top 0.203: SV5.16 61.44,18.65 62.39,19.6 63.18,19.6 64.13,18.65 U3.3
D33
  Top 0.203: U3.18 61.94,18.65 60.93,17.63 57.28,17.63 56.27,18.65 SV5.15
D34
  Top 0.203: SV5.18 61.44,16.11 62.39,17.06 63.18,17.06 64.13,16.11 U3.2
D35
  Top 0.203: U3.19 61.94,16.11 60.93,15.09 57.28,15.09 56.27,16.11 SV5.17
D42
  Top 0.203: SV4.13 10.54,21.19 9.59,20.24 6.51,20.24 5.56,21.19 U2.17
GND  (via drill 0.35)
  Top 1.016: PR1.1F PR1.2F PR1.3F PR1.4F PR1.5F PR1.6F PR1.7F PR1.8F PR1.9F PR1.10F
  other vias: 48,36.25 22.12,48.98 13,49.54 33.45,46.87 34.64,41.76 37,43.01 31.7,47.99
  pour Top: 0.25,55.38 -1.48,10.78 11.22,-1.92 57.71,-1.92 70.66,11.03 70.66,40.24 53.39,57.51 51.86,57.51 47.8,61.58 29.03,61.58
  pour Bottom: -2.24,37.45 -2.24,11.28 10.72,-1.67 59.48,-1.67 68.12,6.97 71.17,10.01 71.17,37.95 71.17,40.49 54.4,57.26 50.34,61.32 28.75,61.32 18.34,61.32 8.94,51.92 -1.73,41.26 -1.73,38.46
MISO
  Top 0.203: SV5.2 61.44,36.43 62.39,37.38 63.18,37.38 64.13,36.43 U3.10
  Top 1.016: PR1.9H PR1.9I PR1.9J
  Bottom 0.203: PR1.9J 49.22,9.76 51.71,12.25 51.71,37.09 52.59,37.97 55.57,37.97 57.11,36.43 SV5.2
MOSI  (via drill 0.35)
  Top 0.203: U3.11 61.94,36.43 60.93,35.41 57.28,35.41 56.27,36.43 SV5.1 55.17,37.19 v53.13,39.22
  Top 1.016: PR1.8J PR1.8I PR1.8H
  Bottom 0.203: PR1.8J 46.89,12.3 49.07,10.12 51.36,12.4 51.36,37.23 53.13,39.01 v53.13,39.22
N$1
  Top 0.508: C11.1 16.68,48.8 U4.1
N$2
  Top 0.152: RN1.1 49.47,2.98 49.49,2.97 48.99,2.47 41.12,2.47 40.15,3.44 32.29,3.44 LED1.A
N$3
  Top 0.152: RN1.2 50.27,2.78 49.65,2.17 40.99,2.17 40.03,3.13 34.47,3.13 LED2.A
N$4
  Top 0.152: RN1.3 51.07,3.53 50.82,3.28 50.82,2.9 49.78,1.86 41.83,1.86 41.6,1.86 39,1.86 LED3.A
N$5
  Top 0.152: RN1.4 51.87,3.83 51.13,3.09 51.13,2.78 49.91,1.56 39.73,1.56 39.45,1.28 37.44,1.28
  Top 0.203: 37.44,1.28 18.17,1.28 LED4.A
N$6  (via drill 0.35)
  Top 0.508: v14.6,51.14 16.04,51.14 C11.2 | D1.C 14.8,39.55 v14.86,39.61 | v20.34,48.06 20.55,48.06 21.97,46.64 U4.8
  Bottom 0.508: v14.6,51.14 16.18,49.56 16.18,42.68 18.59,40.26 U5.P$1 | v14.86,39.61 15.72,38.74 U5.P$1 | U5.P$1 21.84,41.99 21.84,46.57 v20.34,48.06
N$8
  Top 0.406: Q1.6 R1.1 51.25,48.8 51.25,46.74 C2.2
N$9
  Top 0.406: Q1.1 R2.1
N$10
  Top 0.406: Q2.6 39.32,49.9 R4.1 39.77,49.75 40.53,49 40.53,47.35 40.08,46.91 C5.2
N$11
  Top 0.406: Q2.1 R5.1
N$12
  Top 1.016: PR1.6J PR1.6I PR1.6H
N$13
  Top 1.016: PR1.7H PR1.7I PR1.7J
N$14
  Top 0.254: R11.2 R10.2 16.72,33.52 15.72,34.53 15.72,37.42 16.68,38.38 U4.4
N$15
  Top 0.406: R7.1 Q3.6 | Q3.6 | C8.2 30.84,43.49 27.2,43.49 26.69,44.01 Q3.6
N$16
  Top 0.406: Q3.1 28.79,44.52 28.37,44.94 28.37,48.05 R8.1
N$21  (via drill 0.35)
  Top 0.406: v47.9,42.4 48.26,42.4 F1.1
  Bottom 0.406: U1.19 43.74,45.47 46.81,42.4 v47.9,42.4
RX0
  Top 0.203: U2.10 10.04,36.43 11.06,37.45 11.9,37.45 12.91,36.43 SV4.2
RX1
  Top 0.203: SV4.19 10.54,13.57 9.59,12.62 6.51,12.62 5.56,13.57 U2.20
RX2
  Top 0.203: SV4.17 10.54,16.11 9.59,15.16 6.51,15.16 5.56,16.11 U2.19
RX3  (via drill 0.35)
  Top 0.203: U2.18 5.56,18.65 6.51,17.7 9.59,17.7 10.54,18.65 SV4.15 12.77,17.36 15.31,17.36 16.92,15.75 18.48,15.75 20.11,17.38 v20.11,18.4
  Top 1.016: PR1.7A PR1.7B PR1.7C
  Bottom 0.203: PR1.7A 20.11,18.14 v20.11,18.4
SCK
  Top 0.203: SV5.4 61.44,33.89 62.39,34.84 63.18,34.84 64.13,33.89 U3.9
  Top 1.016: PR1.10J PR1.10I PR1.10H
  Bottom 0.203: PR1.10J 46.89,7.22 49.07,9.4 49.36,9.4 52.07,12.11 52.07,36.94 52.74,37.61 55.42,37.61 56.18,36.85 56.18,35.41 SV5.4
SCL  (via drill 0.35)
  Top 0.203: U3.20 61.94,13.57 60.93,12.55 57.28,12.55 56.27,13.57 SV5.19 55.17,12.05 v56.44,10.78
  Top 1.016: PR1.9A PR1.9B PR1.9C
  Bottom 0.203: PR1.9A 21.54,7.88 21.54,4.28 22.51,3.31 47.69,3.31 55.16,10.78 v56.44,10.78
SDA
  Top 0.203: SV5.20 61.44,13.57 62.39,14.52 63.18,14.52 64.13,13.57 U3.1
  Top 1.016: PR1.10C PR1.10B PR1.10A
  Bottom 0.203: PR1.10A 21.89,5.7 21.89,4.43 22.65,3.66 47.55,3.66 57.45,13.57 SV5.20
SS
  Top 0.203: U3.12 61.94,33.89 60.93,32.87 57.28,32.87 56.27,33.89 SV5.3
TX0
  Top 0.203: SV4.1 10.54,36.43 9.59,35.48 6.51,35.48 5.56,36.43 U2.11
TX1
  Top 0.203: U2.1 10.04,13.57 11.06,14.59 11.9,14.59 12.91,13.57 SV4.20
TX2
  Top 0.203: U2.2 10.04,16.11 11.06,17.13 11.9,17.13 12.91,16.11 SV4.18
TX3  (via drill 0.35)
  Top 0.203: U2.3 10.04,18.65 11.06,19.67 11.9,19.67 12.91,18.65 SV4.16 14.53,18.65 17.07,16.11 18.34,16.11 19.2,16.98 v19.2,18.4
  Top 1.016: PR1.8A PR1.8B PR1.8C
  Bottom 0.203: PR1.8A 19.2,16.51 v19.2,18.4
V1  (via drill 0.35)
  Top 0.152: RN1.8 49.47,6.3 49.98,6.81 49.98,10.78 52.03,12.82 53.45,12.82 v54.14,12.12
  Top 0.203: C2.1 51.42,44.86 47.85,44.86 46.97,45.74 C3.2
  Top 0.406: 37.36,39.88 37.36,41.59 38.6,42.83 40.81,42.83 43.72,45.74 C3.2 45.49,47.68 Q1.3 Q1.2
  Top 0.508: PR1.1D 32.31,31.35 v32.31,35.92 | 37.36,39.88 36.75,39.28 35.53,39.28 34.95,38.69 34.95,37.47 35.1,37.32 v35.1,36.18
  Top 1.016: PR1.1D PR1.2D PR1.3D PR1.4D PR1.5D PR1.6D PR1.7D PR1.8D PR1.9D PR1.10D
  Bottom 0.152: PR1.10D 34.26,3.99 47.41,3.99 54.14,10.73 v54.14,12.12
  Bottom 0.508: v32.31,35.92 34.85,35.92 v35.1,36.18
V2  (via drill 0.35)
  Top 0.152: RN1.6 51.07,7.15 50.59,7.63 50.59,10.4 50.97,10.78 v52.63,10.78
  Top 0.203: C5.1 39.33,44.39 38.45,45.27 35.72,45.27 C6.2
  Top 0.406: Q2.2 Q2.3 34.85,47.91 C6.2 33.8,45.1 33.8,42.78 32.2,41.18
  Top 0.508: v31.29,35.16 31.29,36.56 32.2,37.47 32.2,41.18 | v36.37,35.92 38.66,33.64 PR1.1G
  Top 1.016: PR1.10G PR1.9G PR1.8G PR1.7G PR1.6G PR1.5G PR1.4G PR1.3G PR1.2G PR1.1G
  Bottom 0.152: PR1.10G 38.66,5.29 39.34,4.6 47.16,4.6 52.63,10.07 v52.63,10.78
  Bottom 0.508: v31.29,35.16 31.96,35.16 31.98,35.14 35.58,35.14 v36.37,35.92
VEXT
  Bottom 0.508: U1.18 41.2,42.15 42.36,40.98 42.36,40.01 41.2,38.84 SV3.15
VIN  (via drill 0.35)
  Top 0.406: R7.2 24.89,46.42 Q3.4 26.29,46.82 C7.2 | C10.1 C15.1 21.24,49.37 21.99,50.12 21.99,53.3 22.88,54.19 44.73,54.19 v44.8,54.11 | SV3.17 43.74,37.65 46.17,35.21 48,35.21 48.74,35.95 48.74,36.88 F1.2 49.58,37.73 v49.58,36.53
  Top 0.508: C15.1 20.62,49.37 21.8,48.19 22.51,48.19 23.41,47.3 23.61,47.3 R7.2 23.84,45.37 U4.7
  Bottom 0.406: v44.8,54.11 44.8,52.2 44.29,51.7 44.29,45.7 46.87,43.13 48.21,43.13 49.58,41.76 v49.58,36.53
VINSTR
  Bottom 0.203: SV3.9 33.58,39.06 34.59,40.07 34.59,40.91 34.01,41.5 34.01,46.54 34.08,46.61 34.08,47.13 33.58,47.64 U1.15
VUSB
  Bottom 0.508: SV3.18 43.74,41.21 42.63,42.32 42.63,53.4 43.74,54.5 U1.2

### Text on the board
tPlace: A0 | A2 | A4 | A6 | A8 | A9 | A10 | A11 | VUSB | GND | PROTOTYPE / BOARD | V1.3 | TX0 | MOSI | RX0 | A1 | A3 | A5 | A7 | VINSTR | 3V3 | 5V | VEXT | VIN | GND | MISO | CEAZA | D3 | D2 | SS | SCK | V1-D24 | 5V-D27 | GND | V2-D25 | M2 | D5 | D4 | D23 | D22 | A0 | A1 | D7 | D6 | D25 | D24 | A2 | A3 | D9 | D8 | D27 | D25 | ANALOG IN | A5 | ANALOG IN | A4 | D11 | D10 | D29 | D28 | D3 | D4 | D42 | D12 | D6 | D I/O | D31 | D30 | D I/O | D5 | RX3 | TX3 | D33 | D32 | D7 | NC | RX2 | TX2 | NC | FREE | D35 | D34 | RX3 | RX1 | TX1 | SCL | TX3 | MOSI | SDA | SCL | MISO | SPI | +12V | SDA | SCK | 12V | WWW.CEAZA.CL | V1 | 5V | V2
bPlace: PRECAUCION | WARNING / SHORT CIRCUIT / RISK ON / BREADBOARD | RIESGO DE / CORTOCIRCUITO / EN PROTOBOARD | A0 | A2 | A4 | A6 | A8 | A9 | A10 | A11 | VUSB | GND | TX0 | RX0 | A1 | A3 | A5 | A7 | VINSTR | 3V3 | 5V | VEXT | VIN | GND | MISO | MOSI | D3 | D2 | SS | SCK | V1-D24 | 5V-D27 | GND | V2-D25 | D5 | D4 | D23 | D22 | A0 | A1 | D7 | D6 | D25 | D24 | A2 | A3 | D9 | D8 | D26 | ANALOG IN | A4 | A5 | D27 | ANALOG IN | D11 | D10 | D29 | D28 | D3 | D4 | D30 | D42 | D12 | D5 | D6 | D I/O | D31 | D I/O | RX3 | TX3 | D33 | D32 | D7 | NC | RX2 | TX2 | NC | FREE | D35 | D34 | RX3 | RX1 | TX1 | SERIAL | SCL | SDA | TX3 | MOSI | +12V | SCL | MISO | SPI | I2C | SDA | SCK | I/O | POWER | I/O | CEAZA - M2 | WWW.CEAZA.CL | VER 1.3 / JUL 2020 | DESIGN ADRIAN G.